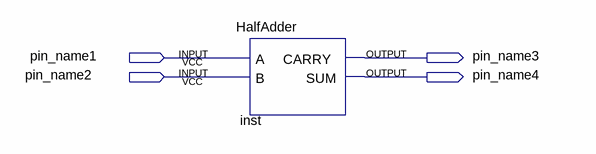
[diagram p0: schematic sheet]
// Quartus schematic test.bdf as structural Verilog: 1 symbols, 4 pins
module test (
  input  pin_name1,
  input  pin_name2,
  output pin_name3,
  output pin_name4
);

  HalfAdder inst (.A(pin_name1), .B(pin_name2), .CARRY(pin_name3), .SUM(pin_name4));
endmodule
